# EAGLE design Analog Breakout Module (EAGLE 6.3)
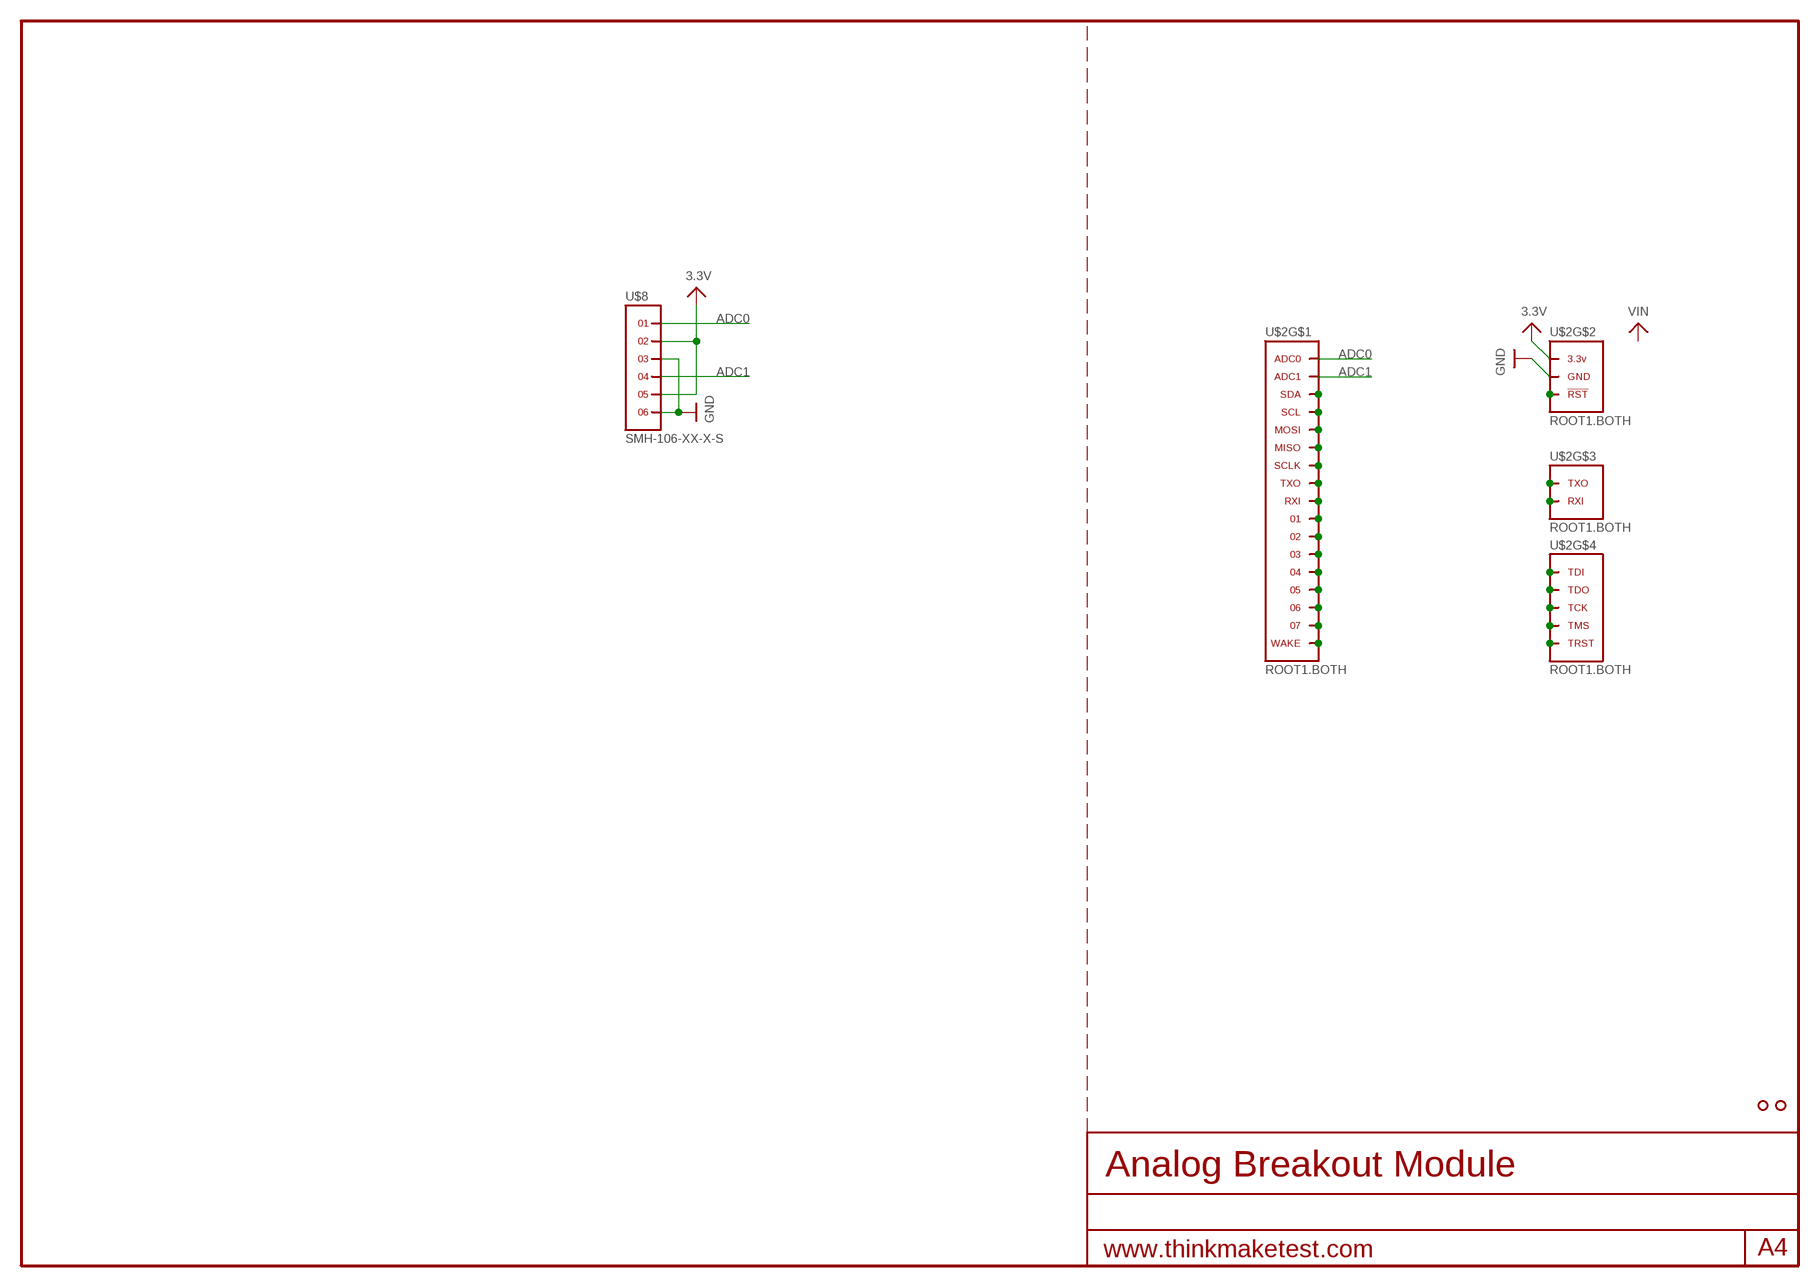
[diagram p0: schematic, sheet 1]

## Parts
U$2  ROOT1.BOTH  [ROOT1.BOTH]
U$3  HOLE.#2  [#2]
U$4  HOLE.#2  [#2]
U$8  SMH-106-XX-X-S  [SMH-106-XX-X-S]

## Nets
3.3V: U$2.3.3V@1(3.3V) U$2.3.3V@2(3.3V) U$2.3.3V@3(3.3V) U$2.3.3V@4(3.3V) U$2.3.3V@5(3.3V) U$2.3.3V@6(3.3V) U$2.3.3V@7(3.3V) U$2.3.3V@8(3.3V) U$2.3.3V@9(3.3V) U$2.3.3V@10(3.3V) U$2.3.3V@11(3.3V) U$2.3.3V@12(3.3V) U$2.3.3V@13(3.3V) U$2.3.3V@14(3.3V) U$2.3.3V@15(3.3V) U$2.3.3V@16(3.3V) U$2.3.3V@17(3.3V) U$2.3.3V@18(3.3V) U$2.3.3V@19(3.3V) U$2.3.3V@20(3.3V) U$2.3.3V@21(3.3V) U$2.3.3V@22(3.3V) U$2.3.3V@23(3.3V) U$2.3.3V@24(3.3V) U$2.3.3V@VIA(3.3V) U$8.2 U$8.5
ADC0: U$2.ADC0 U$2.ADC0@1(ADC0) U$2.ADC0@VIA(ADC0) U$8.1
ADC1: U$2.ADC1 U$2.ADC1@1(ADC1) U$2.ADC1@VIA(ADC1) U$8.4
GND: U$2.GND@1(GND) U$2.GND@2(GND) U$2.GND@3(GND) U$2.GND@4(GND) U$2.GND@5(GND) U$2.GND@6(GND) U$2.GND@7(GND) U$2.GND@8(GND) U$2.GND@9(GND) U$2.GND@10(GND) U$2.GND@11(GND) U$2.GND@12(GND) U$2.GND@13(GND) U$2.GND@14(GND) U$2.GND@15(GND) U$2.GND@16(GND) U$2.GND@17(GND) U$2.GND@18(GND) U$2.GND@19(GND) U$2.GND@20(GND) U$2.GND@21(GND) U$2.GND@22(GND) U$2.GND@23(GND) U$2.GND@24(GND) U$2.GND@25(GND) U$2.GND@26(GND) U$2.GND@VIA(GND) U$8.3 U$8.6
N$1: U$2.04 U$2.04@1 U$2.04@VIA
N$3: U$2.SDA U$2.SDA@1(SDA) U$2.SDA@VIA(SDA)
N$4: U$2.SCL U$2.SCL@1(SCL) U$2.SCL@VIA(SCL)
N$5: U$2.03 U$2.03@1 U$2.03@VIA
N$6: U$2.MISO U$2.MISO@1(MISO) U$2.MISO@VIA(MISO)
N$7: U$2.SCLK U$2.SCLK@1(SCLK) U$2.SCLK@VIA(SCLK)
N$8: U$2.TXO U$2.TXO@1(TXO) U$2.TXO@VIA(TXO)
N$9: U$2.RXI U$2.RXI@1(RXI) U$2.RXI@VIA(RXI)
N$10: U$2.01 U$2.01@1 U$2.01@VIA
N$11: U$2.02 U$2.02@1 U$2.02@VIA
N$12: U$2.MOSI U$2.MOSI@1(MOSI) U$2.MOSI@VIA(MOSI)
N$14: U$2.05 U$2.05@1 U$2.05@VIA
N$15: U$2.06 U$2.06@1 U$2.06@VIA
N$16: U$2.07 U$2.07@1 U$2.07@VIA
N$17: U$2.WAKE U$2.WAKE@1(WAKE) U$2.WAKE@VIA(WAKE)
N$18: U$2.TDI U$2.TDI@1(TDI) U$2.TDI@VIA(TDI)
N$19: U$2.TDO U$2.TDO@1(TDO) U$2.TDO@VIA(TDO)
N$20: U$2.TCK U$2.TCK@1(TCK) U$2.TCK@VIA(TCK)
N$21: U$2.TMS U$2.TMS@1(TMS) U$2.TMS@VIA(TMS)
N$22: U$2.TRST U$2.TRST@1(TRST) U$2.TRST@VIA(TRST)
N$23: U$2.RXI.DBG(RXI) U$2.RXI.DBG@1(RXI) U$2.RXI.DBG@VIA(RXI)
N$24: U$2.TXO.DBG(TXO) U$2.TXO.DBG@1(TXO) U$2.TXO.DBG@VIA(TXO)
N$25: U$2.RST(!RST) U$2.RST@1(!RST) U$2.RST@VIA(!RST)

## Library data of the parts
U$2 = thinkmaketest:ROOT1
U$3 U$4 = .screw_holes:HOLE
U$8 = samtec:SMH-106-XX-X-S

## Board
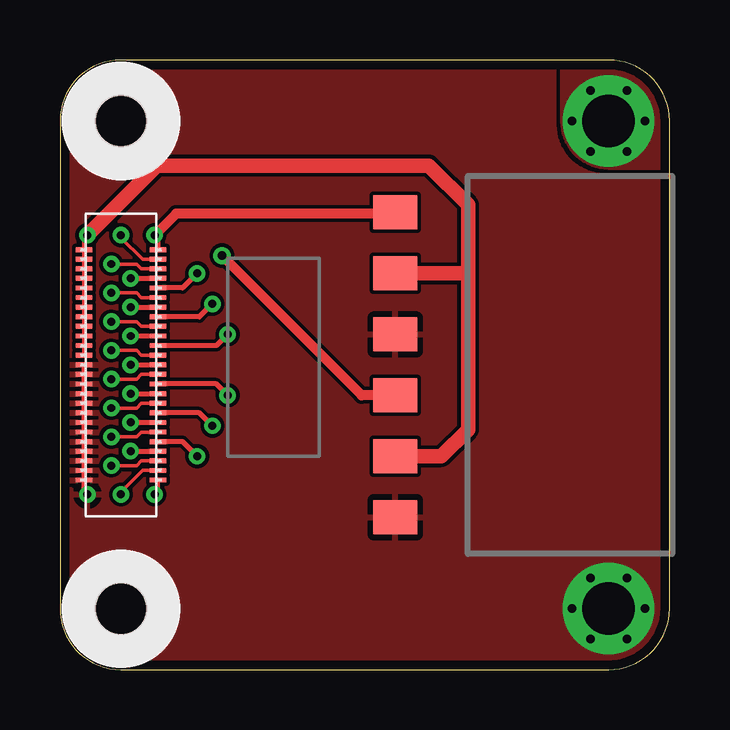
[diagram p1: board, top side]
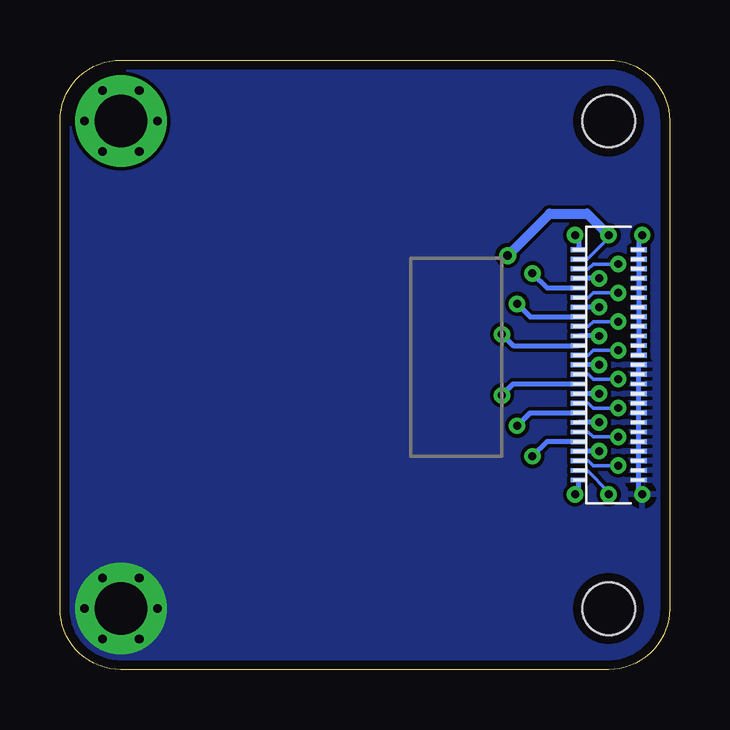
[diagram p2: board, bottom side, seen from below]

Size 25.4 x 25.4 mm. Coordinates in mm from the lower left corner, seen from the top.
Outline: 0,22.86 0,2.54 arc90 2.54,0 22.86,0 arc90 25.4,2.54 25.4,22.86 arc90 22.86,25.4 2.54,25.4 arc90 0,22.86
Copper layers (1*16): Top 0.0356mm / dielectric 1.5011mm / Bottom 0.0356mm
Design rules "default": minimum track width 6mil, minimum drill 13mil, track to track 6mil, track to pad 6mil, pad to pad 6mil, via to via 6mil, smd to smd 6mil, copper to edge 15mil, drill to drill 6mil, minimum pad ring 7mil, minimum via ring 7mil, stop-mask expansion 4mil, vias tented up to drill 16mil, thermal gap 10mil

### Footprints (pad centres in the part's own frame; a part is rotated, then mirrored left to right if it is on the bottom)
ROOT1.BOTH = smd 0.66 x 0.2 bottom: 01 3.795,13.9; 02 3.795,13.5; 03 3.795,13.1; 3.3V@1 1.285,17.5; 3.3V@2 1.285,17.1; 3.3V@3 1.285,16.7; 3.3V@4 1.285,16.3; 3.3V@5 1.285,15.9; 3.3V@6 1.285,15.5; 3.3V@7 1.285,15.1; 3.3V@8 1.285,14.7; 3.3V@9 1.285,14.3; 3.3V@10 1.285,13.9; 3.3V@11 1.285,13.5; 3.3V@12 1.285,13.1; 04 3.795,12.7; 05 3.795,12.3; 06 3.795,11.9; 07 3.795,11.5; ADC0 3.795,17.5; ADC1 3.795,17.1; GND@1 1.285,7.9; GND@2 1.285,8.3; GND@3 1.285,8.7; GND@4 1.285,9.1; GND@5 1.285,9.5; GND@6 1.285,9.9; GND@7 1.285,10.3; GND@8 1.285,10.7; GND@9 1.285,11.1; GND@10 1.285,11.5; GND@11 1.285,11.9; GND@12 1.285,12.3; GND@13 1.285,12.7; MISO 3.795,15.5; MOSI 3.795,15.9; RST 3.795,7.9; RXI 3.795,14.3; RXI.DBG 3.795,10.3; SCL 3.795,16.3; SCLK 3.795,15.1; SDA 3.795,16.7; TCK 3.795,9.1; TDI 3.795,9.9; TDO 3.795,9.5; TMS 3.795,8.7; TRST 3.795,8.3; TXO 3.795,14.7; TXO.DBG 3.795,10.7; WAKE 3.795,11.1 | smd 0.7 x 0.2: 01@1 4.08,13.9; 02@1 4.08,13.5; 3.3V@13 1,17.5; 3.3V@14 1,17.1; 3.3V@15 1,16.7; 3.3V@16 1,16.3; 3.3V@17 1,15.9; 3.3V@18 1,15.5; 3.3V@19 1,15.1; 3.3V@20 1,14.7; 3.3V@21 1,14.3; 3.3V@22 1,13.9; 3.3V@23 1,13.5; 3.3V@24 1,13.1; 03@1 4.08,13.1; 04@1 4.08,12.7; 05@1 4.08,12.3; 06@1 4.08,11.9; 07@1 4.08,11.5; ADC0@1 4.08,17.5; ADC1@1 4.08,17.1; GND@14 1,7.9; GND@15 1,8.3; GND@16 1,8.7; GND@17 1,9.1; GND@18 1,9.5; GND@19 1,9.9; GND@20 1,10.3; GND@21 1,10.7; GND@22 1,11.1; GND@23 1,11.5; GND@24 1,11.9; GND@25 1,12.3; GND@26 1,12.7; MISO@1 4.08,15.5; MOSI@1 4.08,15.9; RST@1 4.08,7.9; RXI.DBG@1 4.08,10.3; RXI@1 4.08,14.3; SCL@1 4.08,16.3; SCLK@1 4.08,15.1; SDA@1 4.08,16.7; TCK@1 4.08,9.1; TDI@1 4.08,9.9; TDO@1 4.08,9.5; TMS@1 4.08,8.7; TRST@1 4.08,8.3; TXO.DBG@1 4.08,10.7; TXO@1 4.08,14.7; WAKE@1 4.08,11.1 | drill 0.33 pad 0.686: 01@VIA 2.94,13.9; 02@VIA 6.985,13.97; 3.3V@VIA 1.14,18.1; 03@VIA 2.14,13.3; 04@VIA 2.94,12.7; 05@VIA 2.14,12.1; 06@VIA 6.985,11.43; 07@VIA 2.94,11.5; ADC0@VIA 3.94,18.1; ADC1@VIA 2.54,18.1; GND@VIA 1.14,7.3; MISO@VIA 2.14,15.7; MOSI@VIA 5.715,16.51; RST@VIA 3.94,7.3; RXI.DBG@VIA 2.94,10.3; RXI@VIA 2.14,14.5; SCL@VIA 2.94,16.3; SCLK@VIA 2.94,15.1; SDA@VIA 2.14,16.9; TCK@VIA 2.94,9.1; TDI@VIA 2.14,9.7; TDO@VIA 5.715,8.89; TMS@VIA 2.14,8.5; TRST@VIA 2.54,7.3; TXO.DBG@VIA 6.35,10.16; TXO@VIA 6.35,15.24; WAKE@VIA 2.14,10.9
#2 = hole 2.184: 0,0
SMH-106-XX-X-S = smd 1.422 x 1.829: 1 -6.35,0; 2 -3.81,0; 3 -1.27,0; 4 1.27,0; 5 3.81,0; 6 6.35,0

### Placement (x,y rotation side)
U$2  0,0 0 top
U$3  2.54,2.54 90 top
U$4  2.54,22.86 90 top
U$8  13.97,12.7 270 top

### Tracks (layer width: path | path; a pad name or v marks a point on that pad's centre or on a via)
3.3V
  Top 0.61: U$8.5 15.89,8.89 17,10 17,16.5 | 17,16.5 17,19.36 15.37,21 4.04,21 U$2.3.3V@VIA | U$8.2 16.99,16.51 17,16.5
ADC0
  Top 0.406: U$8.1 13.92,19 4.84,19 U$2.ADC0@VIA
ADC1  (via drill 0.36)
  Top 0.406: U$8.4 12.57,11.43 v6.75,17.25
  Bottom 0.406: v6.75,17.25 5,19 3.44,19 U$2.ADC1@VIA
GND  (via drill 0.36, 2.18 pad 3.81)
  other vias: 22.86,2.54 21.34,2.54 24.38,2.54 22.1,3.81 23.62,3.81 23.62,1.27 22.1,1.27
  pour Bottom (rank 6): 0,0 25.4,0 25.4,25.4 0,25.4
  pour Top (rank 6): 0,0 25.4,0 25.4,25.4 0,25.4
VIN  (via drill 0.36, 2.18 pad 3.81)
  other vias: 22.86,22.86 24.38,22.86 21.34,22.86 22.1,24.13 23.62,24.13 23.62,21.59 22.1,21.59
  pour Top: 20.95,25.4 20.95,22.86 arc90 22.86,20.95 25.4,20.95 25.4,22.86 arc90 22.86,25.4

### Text on the board
tDocu: ADC0 / 3.3v / GND / ADC1 / 3.3v / GND
bDocu: ADC0 / 3.3v / GND / ADC1 / 3.3v / GND | v1 | Cruz Monrreal II | AnomalousMaker.com